# Altium schematic sheet PWR.SchDoc
size A3; SheetNumber: 3; SheetTotal: 6
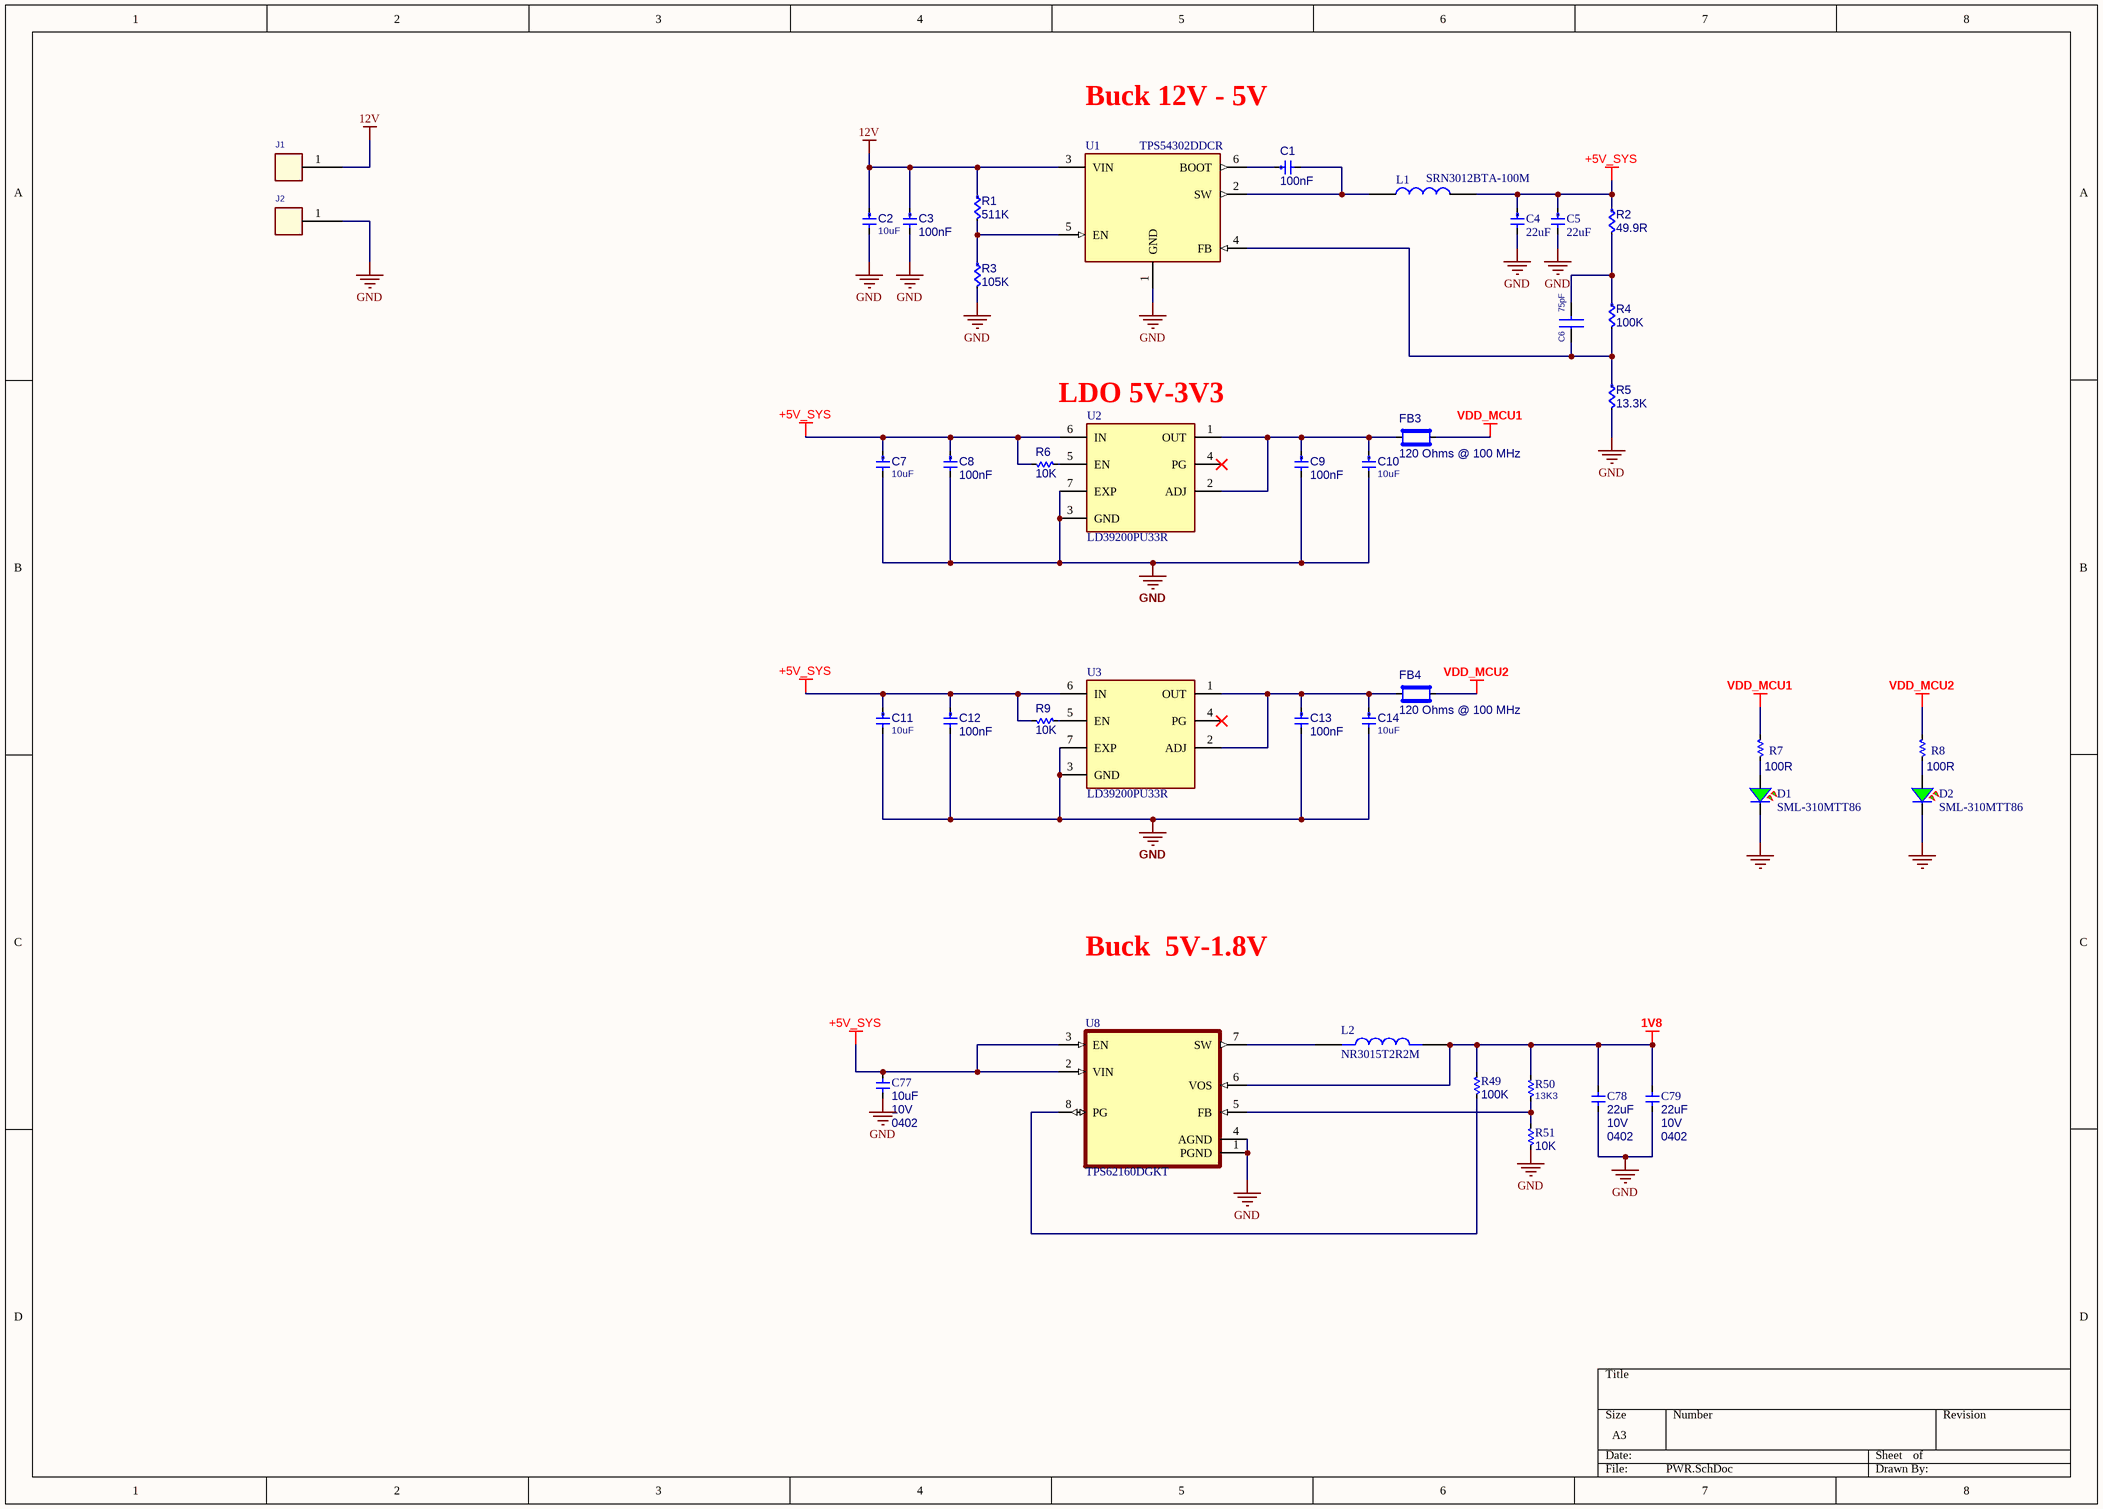
[diagram p0: PWR.SchDoc]

## Parts
C1  Capacitance: 100nF  [CAP0402]  (hidden comment: CC0402KRX5R9BB104)
C2  Capacitance: 10uF  [CAP0603-M]  (hidden comment: GRM188R6YA106MA73D)
C3  Capacitance: 100nF  [CAP0402]  (hidden comment: CC0402KRX5R9BB104)
C4  Capacitance: 22uF  [CAP0402]  (hidden comment: GRM158R61A226ME15D)
C5  Capacitance: 22uF  [CAP0402]  (hidden comment: GRM158R61A226ME15D)
C6  75pF  [CAP0402]
C7  Capacitance: 10uF  [CAP0603]  (hidden comment: GRM188R6YA106MA73D)
C8  Capacitance: 100nF  [CAP0402]  (hidden comment: CC0402KRX5R9BB104)
C9  Capacitance: 100nF  [CAP0402]  (hidden comment: CC0402KRX5R9BB104)
C10  Capacitance: 10uF  [CAP0603]  (hidden comment: GRM188R6YA106MA73D)
C11  Capacitance: 10uF  [CAP0603]  (hidden comment: GRM188R6YA106MA73D)
C12  Capacitance: 100nF  [CAP0402]  (hidden comment: CC0402KRX5R9BB104)
C13  Capacitance: 100nF  [CAP0402]  (hidden comment: CC0402KRX5R9BB104)
C14  Capacitance: 10uF  [CAP0603]  (hidden comment: GRM188R6YA106MA73D)
C77  value 10uF  Voltage: 10V  Package: 0402  [CAP0402]  (hidden comment: CAP0402 10uF 10V)
C78  value 22uF  Voltage: 10V  Package: 0402  [CAP0402]  (hidden comment: CAP0402 22uF 10V)
C79  value 22uF  Voltage: 10V  Package: 0402  [CAP0402]  (hidden comment: CAP0402 22uF 10V)
D1  SML-310MTT86  [LED0603 GREEN]
D2  SML-310MTT86  [LED0603 GREEN]
FB3  Impedance @ Frequency: 120 Ohms @ 100 MHz  [FERRIT0402]  (hidden comment: BLM15PX121SZ1D)
FB4  Impedance @ Frequency: 120 Ohms @ 100 MHz  [FERRIT0402]  (hidden comment: BLM15PX121SZ1D)
J1  CON1  [wire1_220s]  (value not drawn)
J2  CON1  [wire1_220s]  (value not drawn)
L1  SRN3012BTA-100M  [SRN3012BTA-100M]
L2  NR3015T2R2M  [IND_NR3015T2R2M]
R1  511K  [RES0402]
R2  49.9R  [RES0402]
R3  105K  [RES0402]
R4  100K  [RES0402]
R5  13.3K  [RES0402]
R6  value 10K  [RES0402]  (hidden comment: RES0402 10K)
R7  value 100R  [RES0402]  (hidden comment: RES0402 100R)
R8  value 100R  [RES0402]  (hidden comment: RES0402 100R)
R9  value 10K  [RES0402]  (hidden comment: RES0402 10K)
R49  value 100K  [RES0402]  (hidden comment: RES0402 100K)
R50  value 13K3  [RES0402]  (hidden comment: RES0402 13K3)
R51  value 10K  [RES0402]  (hidden comment: RES0402 10K)
U1  TPS54302DDCR  [SOT95P280X110-6N - duplicate1]
U2  LD39200PU33R  [LD39200PUR]
U3  LD39200PU33R  [LD39200PUR]
U8  TPS62160DGKT  [SOP65P490X110-8N]

## Nets
1V8: C78.2 C79.2 L2.2 R49.2 R50.2 U8.6(VOS)
12V: C2.1 C3.1 J1.1 R1.1 U1.3(VIN)
+5V_SYS: C4.1 C5.1 C7.1 C8.1 C11.1 C12.1 C77.2 L1.2 R2.1 R6.2 R9.2 U2.6(IN) U3.6(IN) U8.2(VIN) U8.3(EN)
GND: C2.2 C3.2 C4.2 C5.2 C7.2 C8.2 C9.2 C10.2 C11.2 C12.2 C13.2 C14.2 C77.1 C78.1 C79.1 D1.1 D2.1 J2.1 R3.2 R5.2 R51.1 U1.1(GND) U2.3(GND) U2.7(EXP) U3.3(GND) U3.7(EXP) U8.1(PGND) U8.4(AGND)
VDD_MCU1: FB3.2 R7.2
VDD_MCU2: FB4.2 R8.2
NetC1_1: C1.1 U1.6(BOOT)
NetC1_2: C1.2 L1.1 U1.2(SW)
NetC6_1: C6.1 R4.2 R5.1 U1.4(FB)
NetC6_2: C6.2 R2.2 R4.1
NetC9_1: C9.1 C10.1 FB3.1 U2.1(OUT) U2.2(ADJ)
NetC13_1: C13.1 C14.1 FB4.1 U3.1(OUT) U3.2(ADJ)
NetD1_2: D1.2 R7.1
NetD2_2: D2.2 R8.1
NetL2_1: L2.1 U8.7(SW)
NetR1_2: R1.2 R3.1 U1.5(EN)
NetR6_1: R6.1 U2.5(EN)
NetR9_1: R9.1 U3.5(EN)
NetR49_1: R49.1 U8.8(PG)
NetR50_1: R50.1 R51.2 U8.5(FB)

Not connected (* = marked no-connect by the designer): U2 4(PG)*; U3 4(PG)*

## Notes on the sheet
- Buck 12V - 5V
- (near U2) LDO 5V-3V3
- Buck  5V-1.8V

## Library data of the parts
C1 C3 C8 C9 C12 C13 = CMP-00265-1: CAP CER 0.1UF 50V X5R 0402; Manufacturer: Yageo; Tolerance: 10%; Voltage Rating: 50V; Dielectric: X5R; Width: 0.02inch; Thickness: 0.022inch; Packaging: Tape and Reel; Length: 0.039inch; Mount: Surface Mount; Case/Package: 0402; Min Operating Temperature: -55°C; Halogen Free: Halogen Free; Voltage Rating (DC): 50V; Manufacturer Part Number: CC0402KRX5R9BB104; Max Operating Temperature: 85°C; Lead Free: Lead Free; Manufacturer 1: Yageo; Manufacturer Part Number 1: CC0402KRX5R9BB104
C2 C7 C10 C11 C14 = CMP-01031-1: CAP CER 10UF 35V X5R 0603; Manufacturer 1: Murata Electronics; Tolerance: 20%; Case/Package: 0603; Depth: 0.8mm; Composition: Ceramic; Length: 1.6mm; Max Operating Temperature: 85°C; Lead Free: Lead Free; Thickness: 0.031inch; Number of Pins: 2; Weight: 0.000222oz; Min Operating Temperature: -55°C; REACH SVHC: No SVHC; Case Code (Metric): 1608; Termination: SMD/SMT; Packaging: Tape and Reel; Height: 0.8mm; Voltage Rating (DC): 35V; Width: 0.031inch; Voltage Rating: 35V; Manufacturer Part Number 1: GRM188R6YA106MA73D; Mount: Surface Mount; Package Quantity: 1; Case Code (Imperial): 0603; Dielectric: X5R; Voltage: 35V
C4 C5 = CMP-00520-1: CAP CER 22UF 10V X5R 0402; Manufacturer 1: TDK Corporation; Tolerance: 10%; Case Code (Imperial): 0402; Case/Package: 0402; Voltage: 10V; Min Operating Temperature: -55°C; Termination: SMD/SMT; Voltage Rating: 10V; Length: 1mm; REACH SVHC: No SVHC; Max Operating Temperature: 85°C; Radiation Hardening: No; Depth: 0.5mm; Case Code (Metric): 1005; Dielectric: X5R; Manufacturer Part Number 1: GRM158R61A226ME15D; Packaging: Tape and Reel
C6 = CAP_Dup1_16: CAP CER 75PF 25V C0G/NP0 0402; Manufacturer PN: CC0402JRNPO9BN750; Manufacturer: YAGEO; PART_NUMBER: TMP-416; CLASS: DISCRETE; Tolerance: 5%; Temperature Coefficient: C0G, NP0; Dielectric Type: Capacitors; Rated Voltage: 25V; Package Size: 0402 (1005 Metric)
C77 = CAP0402 10uF 10V: Cap 10uF 10V 0402; MP: GRT155R61A106ME13D
C78 C79 = CAP0402 22uF 10V: Cap 22uF 10V 0402; MP: GRM158R61A226ME15D
D1 D2 = CMP-01130-2: LED GREEN CLEAR 0603 SMD; Manufacturer 1: Rohm Semiconductor; Luminous Intensity: 16mcd; Wavelength: 570nm; Number of LEDs: 1; Color: Green,Yellow; Forward Voltage: 2.2V; Lens Color: Colorless,Clear; Forward Current: 20mA; Viewing Angle: 140°; Lens Style: Rectangular,Clear,Diffused,Colorless; Case Code (Imperial): 0603; Lens Transparency: Clear; Package Quantity: 3000; Width: 0.8mm; Manufacturer Part Number 1: SML-310MTT86; Min Operating Temperature: -30°C; Length: 1.6mm; Packaging: Tape and Reel; Dominant Wavelength: 570nm; Height: 0.9mm; Radiation Hardening: No; Test Current: 20mA; Case Code (Metric): 1608; Lead Free: Lead Free; Case/Package: 0603; Mount: Surface Mount; Max Operating Temperature: 85°C; Illumination Color: Green; Number of Pins: 2
FB3 FB4 = BLM15PX121SZ1D: 120 Ohms @ 100 MHz 1 Power Line Ferrite Bead 0402 (1005 Metric) 2A 55mOhm; MP: BLM15PX121SZ1D; Current Rating (Max): 2A; DC Resistance (DCR) (Max): 55mOhm
J1 J2 = CON1: SOLDER PADS
L1 = SRN3012BTA-330M: 10uH; Manufacturer_Name: Bourns; Geometry.Height: 1.2mm; Mouser Part Number: SRN3012BTA-100M; Mouser Price/Stock: https://www.mouser.co.uk/ProductDetail/Bourns/SRN3012BTA-330M?qs=Imq1NPwxi74rPoSZ4PPaRw%3D%3D; Manufacturer_Part_Number: SRN3012BTA-100M; Datasheet Link: https://www.bourns.com/docs/Product-Datasheets/SRN3012BTA.pdf
L2 = NR3015T2R2M: 2.2 ÂµH Shielded Drum Core, Wirewound Inductor 1.5 A 72mOhm Max Nonstandard; MF: Taiyo Yuden; MP: NR3015T2R2M; Price: None; Purchase-URL: https://pricing.snapeda.com/search/part/NR3015T2R2M/?ref=eda; Package: Nonstandard Taiyo Yuden; Check_prices: https://www.snapeda.com/parts/NR3015T2R2M/Taiyo+Yuden/view-part/?ref=eda; Value: *; Availability: In Stock; SnapEDA_Link: https://www.snapeda.com/parts/NR3015T2R2M/Taiyo+Yuden/view-part/?ref=snap
R1 = CMP-00299-1_1: RES SMD 511K OHM 1% 1/16W 0402; Manufacturer: Yageo; Manufacturer Part Number: RC0402FR-07511KL; Temperature Coefficient: 100ppm/°C; Working Voltage: 50V; Max Power Dissipation: 63mW; Power Rating: 62.5mW; Height: 0.016inch; Package Quantity: 1; Min Operating Temperature: -55°C; Tolerance: 1%; Military Standard: Not; Packaging: Tape and Reel; Number of Terminations: 2; Width: 0.02inch; Case/Package: 0402; Length: 1mm; Voltage Rating (DC): 50V; Case Code (Metric): 1005; Resistance: 511K; Composition: Thick Film; Voltage Rating: 50V; Max Operating Temperature: 155°C; Case Code (Imperial): 0402; Lead Free: Lead Free; Termination: SMD/SMT; Features: Moisture Resistant; Depth: 0.5mm; Manufacturer 1: Yageo; Manufacturer Part Number 1: RC0402FR-07511KL
R2 = CMP-00299-1_1: RES SMD 49.9R OHM 1% 1/16W 0402; Manufacturer: Yageo; Manufacturer Part Number: RC0402FR-0749R9L; Temperature Coefficient: 100ppm/°C; Working Voltage: 50V; Max Power Dissipation: 63mW; Power Rating: 62.5mW; Height: 0.016inch; Package Quantity: 1; Min Operating Temperature: -55°C; Tolerance: 1%; Military Standard: Not; Packaging: Tape and Reel; Number of Terminations: 2; Width: 0.02inch; Case/Package: 0402; Length: 1mm; Voltage Rating (DC): 50V; Case Code (Metric): 1005; Resistance: 49.9R; Composition: Thick Film; Voltage Rating: 50V; Max Operating Temperature: 155°C; Case Code (Imperial): 0402; Lead Free: Lead Free; Termination: SMD/SMT; Features: Moisture Resistant; Depth: 0.5mm; Manufacturer 1: Yageo; Manufacturer Part Number 1: RC0402FR-0749R9L
R3 = CMP-00299-1_1: RES SMD 105K OHM 1% 1/16W 0402; Manufacturer: Yageo; Manufacturer Part Number: RC0402FR-07105KL; Temperature Coefficient: 100ppm/°C; Working Voltage: 50V; Max Power Dissipation: 63mW; Power Rating: 62.5mW; Height: 0.016inch; Package Quantity: 1; Min Operating Temperature: -55°C; Tolerance: 1%; Military Standard: Not; Packaging: Tape and Reel; Number of Terminations: 2; Width: 0.02inch; Case/Package: 0402; Length: 1mm; Voltage Rating (DC): 50V; Case Code (Metric): 1005; Resistance: 105K; Composition: Thick Film; Voltage Rating: 50V; Max Operating Temperature: 155°C; Case Code (Imperial): 0402; Lead Free: Lead Free; Termination: SMD/SMT; Features: Moisture Resistant; Depth: 0.5mm; Manufacturer 1: Yageo; Manufacturer Part Number 1: RC0402FR-07105KL
R4 = CMP-00299-1_1: RES SMD 100K OHM 1% 1/16W 0402; Manufacturer: Yageo; Manufacturer Part Number: RC0402FR-07100KL; Temperature Coefficient: 100ppm/°C; Working Voltage: 50V; Max Power Dissipation: 63mW; Power Rating: 62.5mW; Height: 0.016inch; Package Quantity: 1; Min Operating Temperature: -55°C; Tolerance: 1%; Military Standard: Not; Packaging: Tape and Reel; Number of Terminations: 2; Width: 0.02inch; Case/Package: 0402; Length: 1mm; Voltage Rating (DC): 50V; Case Code (Metric): 1005; Resistance: 100K; Composition: Thick Film; Voltage Rating: 50V; Max Operating Temperature: 155°C; Case Code (Imperial): 0402; Lead Free: Lead Free; Termination: SMD/SMT; Features: Moisture Resistant; Depth: 0.5mm; Manufacturer 1: Yageo; Manufacturer Part Number 1: RC0402FR-07100KL
R5 = CMP-00299-1_1: RES SMD 13.3K OHM 1% 1/16W 0402; Manufacturer: Yageo; Manufacturer Part Number: RC0402FR-0713K3L; Temperature Coefficient: 100ppm/°C; Working Voltage: 50V; Max Power Dissipation: 63mW; Power Rating: 62.5mW; Height: 0.016inch; Package Quantity: 1; Min Operating Temperature: -55°C; Tolerance: 1%; Military Standard: Not; Packaging: Tape and Reel; Number of Terminations: 2; Width: 0.02inch; Case/Package: 0402; Length: 1mm; Voltage Rating (DC): 50V; Case Code (Metric): 1005; Resistance: 13.3K; Composition: Thick Film; Voltage Rating: 50V; Max Operating Temperature: 155°C; Case Code (Imperial): 0402; Lead Free: Lead Free; Termination: SMD/SMT; Features: Moisture Resistant; Depth: 0.5mm; Manufacturer 1: Yageo; Manufacturer Part Number 1: RC0402FR-0713K3L
R6 R9 R51 = RES0402 10K: RES 10K 0402; MP: RC0402FR-0710KL
R7 R8 = RES0402 100R: RES 100R 0402; MP: RC0402FR-07100RL
R49 = RES0402 100K: RES 100K 0402; MP: RC0402FR-07100KL
R50 = RES0402 13K3: RES 13K3 0402; MP: RC0402FR-0713K3L
U1 = TPS54302DDCR: 4.5-V to 28-V Input, 3-A Output, EMI Friendly Synchronous Step-Down Converter; MF: Texas Instruments; Package: SOT-23-THN-6 Texas Instruments; Price: None; Check_prices: https://www.snapeda.com/parts/TPS54302DDCR/Texas+Instruments/view-part/?ref=eda; Value: *; SnapEDA_Link: https://www.snapeda.com/parts/TPS54302DDCR/Texas+Instruments/view-part/?ref=snap; MP: TPS54302DDCR; Availability: In Stock; Purchase-URL: https://pricing.snapeda.com/search?q=TPS54302DDCR&ref=eda
U2 U3 = LD39200PUR: LDO IC 1 Output 2A 6-DFN _3x3_; MF: STMicroelectronics; Package: DFN-6 STMicroelectronics; Availability: Unavailable; MP: LD39200PU33R; Value: *; SnapEDA_Link: https://www.snapeda.com/parts/LD39200PUR/STMicroelectronics/view-part/882017/?ref=snap; Price: None
U8 = TPS62160DGKT: 3V-17V 1A Step-Down Converters with DCS-Controlâ„¢; MF: Texas Instruments; SnapEDA_Link: https://www.snapeda.com/parts/TPS62160DGKT/Texas+Instruments/view-part/?ref=snap; Package: VSSOP-8 Texas Instruments; Value: *; MP: TPS62160DGKT; Check_prices: https://www.snapeda.com/parts/TPS62160DGKT/Texas+Instruments/view-part/?ref=eda